# EAGLE design ChargeControllerMainBoard (EAGLE 9.2.2)
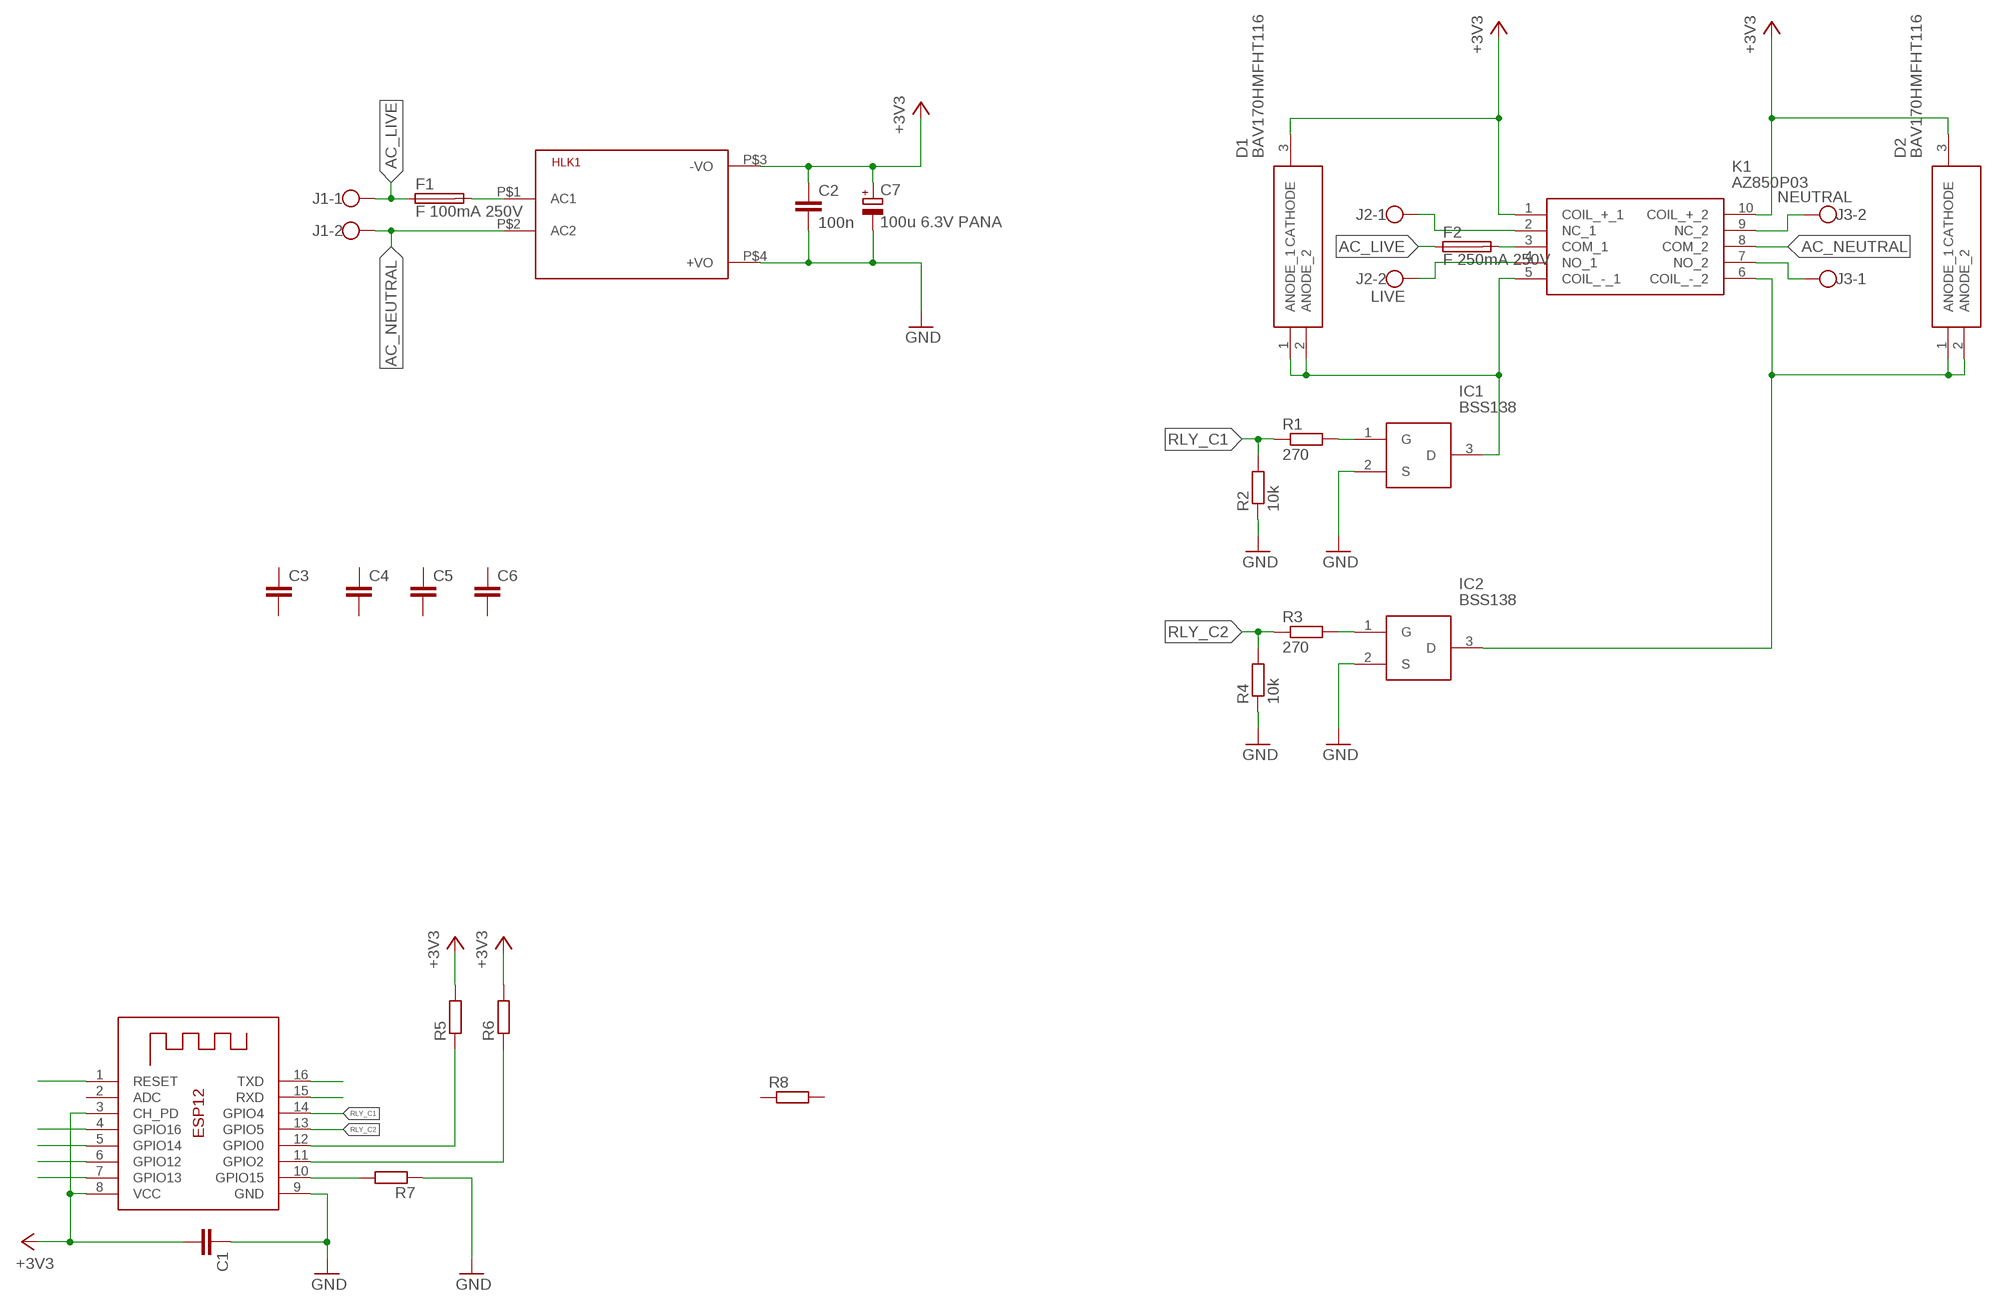
[diagram p0: schematic, sheet 1]

## Parts
C1  C-EUC0805  [C0805]
C2  100n  C-EUC0805  [C0805]
C3  C-EUC0805  [C0805]
C4  C-EUC0805  [C0805]
C5  C-EUC0805  [C0805]
C6  C-EUC0805  [C0805]
C7  100u 6.3V PANA  CPOL-EUB  [PANASONIC_B]
D1  BAV170HMFHT116  [SOT95P240X115-3N]
D2  BAV170HMFHT116  [SOT95P240X115-3N]
F1  F 100mA 250V  SH22,5  [SH22,5]
F2  F 250mA 250V  SH22,5  [SH22,5]
HLK1  HLK-PM03  HLK-PM013W  [HLK-PM01]
IC1  BSS138  [SOT95P240X120-3N]
IC2  BSS138  [SOT95P240X120-3N]
J1  W237-102  [W237-102]
J2  LIVE  W237-102  [W237-102]
J3  NEUTRAL  W237-102  [W237-102]
K1  AZ850P03  AZ850P25  [DIPS763W51P254L1400H525Q10N]
R1  270  R-EU_R0805  [R0805]
R2  10k  R-EU_R0805  [R0805]
R3  270  R-EU_R0805  [R0805]
R4  10k  R-EU_R0805  [R0805]
R5  R-EU_R0805  [R0805]
R6  R-EU_R0805  [R0805]
R7  R-EU_R0805  [R0805]
R8  R-EU_R0805  [R0805]
X1  ESP-12  [ESP-12]

## Nets
+3V3: C1.2 C2.1 C7.+ D1.3(CATHODE) D2.3(CATHODE) HLK1.P$3(-VO) K1.1(COIL_+_1) K1.10(COIL_+_2) R5.2 R6.2 X1.3(CH_PD) X1.8(VCC)
AC_LIVE: F1.1 F2.1 J1.1
AC_NEUTRAL: HLK1.P$2(AC2) J1.2 K1.8(COM_2)
GND: C1.1 C2.2 C7.- HLK1.P$4(+VO) IC1.2(S) IC2.2(S) R2.1 R4.1 R7.1 X1.9(GND)
N$1: IC2.1(G) R3.2
N$2: D1.1(ANODE_1) D1.2(ANODE_2) IC1.3(D) K1.5(COIL_-_1)
N$3: IC1.1(G) R1.2
N$4: D2.1(ANODE_1) D2.2(ANODE_2) IC2.3(D) K1.6(COIL_-_2)
N$6: J2.1 K1.2(NC_1)
N$7: J2.2 K1.4(NO_1)
N$8: J3.2 K1.9(NC_2)
N$10: J3.1 K1.7(NO_2)
N$11: R5.1 X1.12(GPIO0)
N$12: R6.1 X1.11(GPIO2)
N$13: R7.2 X1.10(GPIO15)
N$14: X1.7(GPIO13)
N$15: X1.6(GPIO12)
N$16: X1.5(GPIO14)
N$17: X1.4(GPIO16)
N$18: X1.1(RESET)
N$20: F1.2 HLK1.P$1(AC1)
N$21: X1.15(RXD)
N$22: X1.16(TXD)
N$24: F2.2 K1.3(COM_1)
RLY_C1: R1.1 R2.2 X1.14(GPIO4)
RLY_C2: R3.1 R4.2 X1.13(GPIO5)
Unconnected: C3.1 C3.2 C4.1 C4.2 C5.1 C5.2 C6.1 C6.2 R8.1 R8.2 X1.2(ADC)

## Library data of the parts
C1-C6 = rcl:C-EU: CAPACITOR, European symbol; SPICEPREFIX: C
C7 = rcl:CPOL-EU: POLARIZED CAPACITOR, European symbol; SPICEPREFIX: C
D1 D2 = BAV170HMFHT116:BAV170HMFHT116: Diodes - General Purpose, Power, Switching 90VVrm 80V Vr 0.215A Io 150mA Source: Datasheet <http://rohmfs.rohm.com/en/products/databook/datasheet/discrete/diode/switching/bav170hmfht116-e.pdf>; DESCRIPTION: Diodes - General Purpose, Power, Switching 90VVrm 80V Vr 0.215A Io 150mA; HEIGHT: 1.15mm; MANUFACTURER_NAME: ROHM Semiconductor; MANUFACTURER_PART_NUMBER: BAV170HMFHT116; MOUSER_PART_NUMBER: 755-BAV170HMFHT116; MOUSER_PRICE-STOCK: https://www.mouser.com/Search/Refine.aspx?Keyword=755-BAV170HMFHT116
F1 F2 = fuse:SH22,5: FUSE HOLDER grid 22,5 mm, OGN0031 8201, Schurter (Buerklin); MF: SCHURTER; MPN: 0031.8201; OC_FARNELL: 1162740; OC_NEWARK: 96F8317
HLK1 = HLK-PM01:HLK-PM01: Hi-Link Power Supply HLK-PM01 3W Author: Ahmed Said <https://github.com/AhmedSaid/EAGLELibraries>
IC1 IC2 = BSS138:BSS138: MOSFET N-Channel 50V 0.22A SOT23 Fairchild BSS138 N-channel MOSFET Transistor, 0.22 A, 50 V, 3-Pin SOT-23 Source: Datasheet <http://docs-emea.rs-online.com/webdocs/0d22/0900766b80d22ec5.pdf>; DESCRIPTION: MOSFET N-Channel 50V 0.22A SOT23 Fairchild BSS138 N-channel MOSFET Transistor, 0.22 A, 50 V, 3-Pin SOT-23; HEIGHT: 1.2mm; MANUFACTURER_NAME: Fairchild Semiconductor; MANUFACTURER_PART_NUMBER: BSS138; MOUSER_PART_NUMBER: 512-BSS138; MOUSER_PRICE-STOCK: https://www.mouser.com/Search/Refine.aspx?Keyword=512-BSS138; RS_PART_NUMBER: 1241694; RS_PRICE-STOCK: http://uk.rs-online.com/web/p/products/1241694
J1-J3 = con-wago-500:W237-102: WAGO SCREW CLAMP; MPN: 237-102; OC_FARNELL: unknown; OC_NEWARK: 70K9898
K1 = AZ850P25:AZ850P25: MICROMINIATURE POLARIZED RELAY, 5 VDC, 10 VDC max Source: Datasheet <http://www.azettler.com/pdfs/az850.pdf>; DESCRIPTION: MICROMINIATURE POLARIZED RELAY, 5 VDC, 10 VDC max; HEIGHT: 5.254mm; MANUFACTURER_NAME: American Zettler; MANUFACTURER_PART_NUMBER: AZ850P2&ndash;5
R1-R8 = rcl:R-EU_: RESISTOR, European symbol; SPICEPREFIX: R
X1 = adafruit:ESP-12

## Net classes
0 default: clearance 0.205 mm

## Board
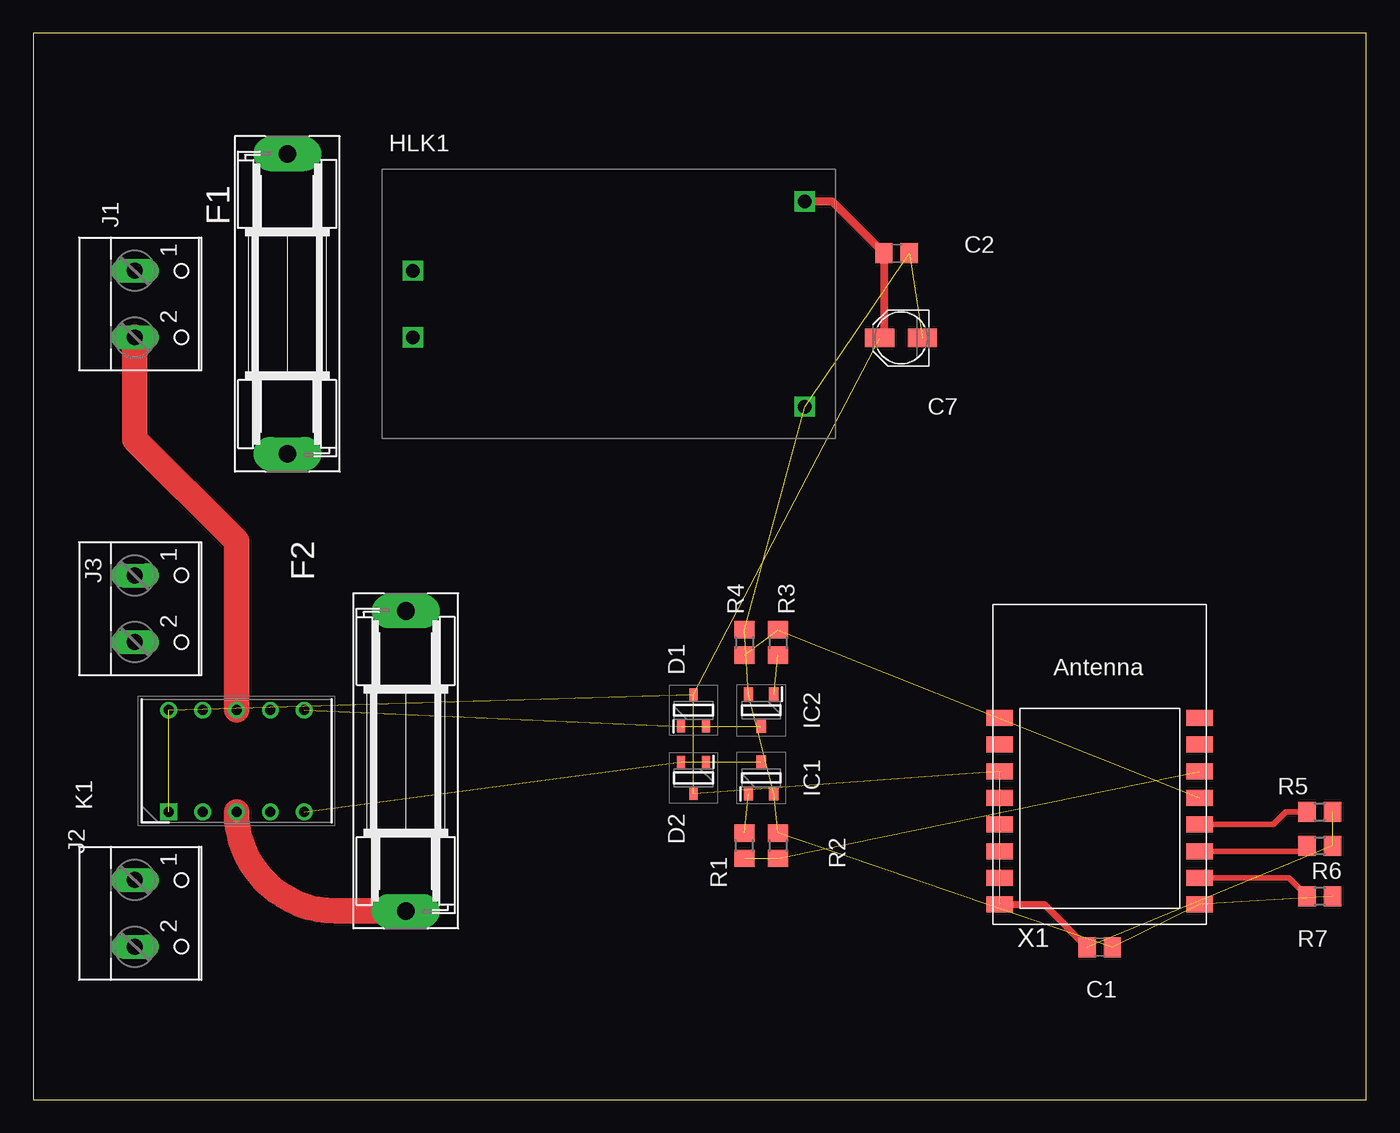
[diagram p1: board, top side]
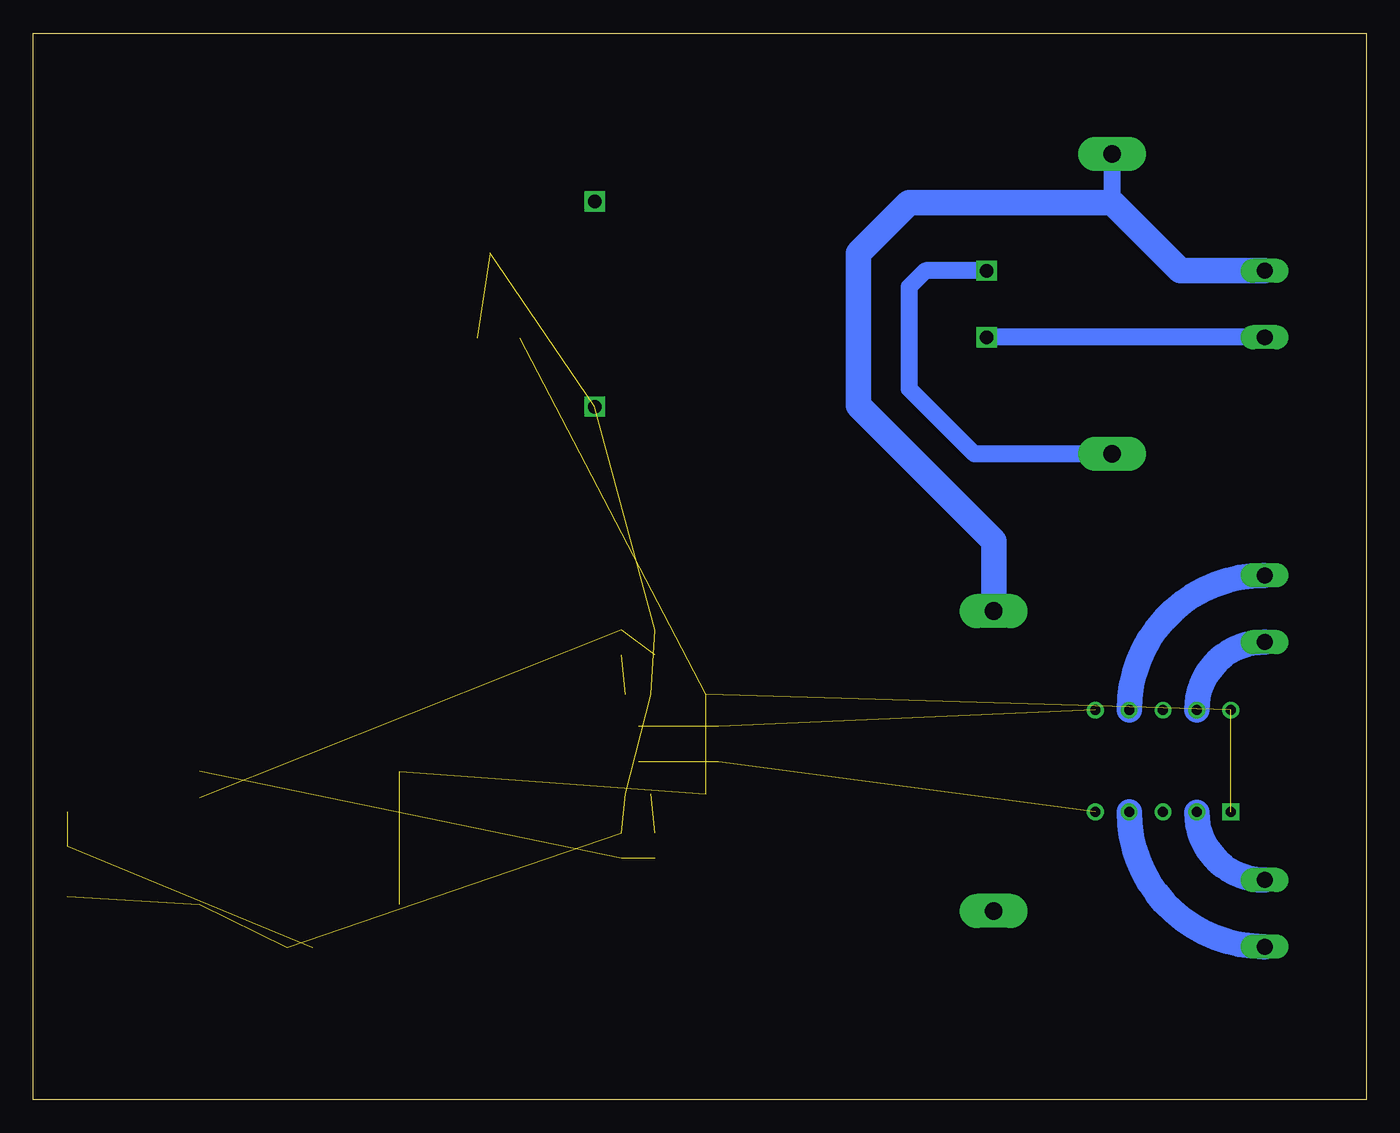
[diagram p2: board, bottom side, seen from below]

Size 100 x 80 mm. Coordinates in mm from the lower left corner, seen from the top.
Outline: 0,0 100,0 100,80 0,80 0,0
Copper layers (1*16): Top 0.035mm / dielectric 1.5mm / Bottom 0.035mm
Design rules "default": minimum track width 6mil, minimum drill 0.35mm, track to track 6mil, track to pad 6mil, pad to pad 6mil, via to via 6mil, smd to smd 6mil, copper to edge 40mil, drill to drill 6mil, minimum pad ring 10mil, minimum via ring 8mil, stop-mask expansion 4mil, vias tented up to drill 0mil, thermal gap 10mil

### Footprints (pad centres in the part's own frame; a part is rotated, then mirrored left to right if it is on the bottom)
C0805 = smd 1.3 x 1.5: 1 -0.95,0; 2 0.95,0
PANASONIC_B = smd 2.2 x 1.4: + 1.6,0; - -1.6,0
SOT95P240X115-3N = smd 0.9 x 0.6: 1 -1.2,0.95; 2 -1.2,-0.95; 3 1.2,0
SH22,5 = drill 1.321 pad 2.54 long: 1 -11.252,0; 2 11.252,0
HLK-PM01 = drill 1.016 square: P$1 -14.7,2.5; P$2 -14.7,-2.5; P$3 14.7,7.7; P$4 14.7,-7.7
SOT95P240X120-3N = smd 1 x 0.7: 1 -1.2,0.95; 2 -1.2,-0.95; 3 1.2,0
W237-102 = drill 1.194 long: 1 -2.5,-1.27; 2 2.5,-1.27
DIPS763W51P254L1400H525Q10N = drill 0.75 pad 1.15 square: 1 0,0 | drill 0.75 pad 1.15: 2 0,-2.54; 3 0,-5.08; 4 0,-7.62; 5 0,-10.16; 6 7.63,-10.16; 7 7.63,-7.62; 8 7.63,-5.08; 9 7.63,-2.54; 10 7.63,0
R0805 = smd 1.3 x 1.5: 1 -0.95,0; 2 0.95,0
ESP-12 = smd 2 x 1.2: 1 -7.5,4.5; 2 -7.5,2.5; 3 -7.5,0.5; 4 -7.5,-1.5; 5 -7.5,-3.5; 6 -7.5,-5.5; 7 -7.5,-7.5; 8 -7.5,-9.5; 9 7.5,-9.5; 10 7.5,-7.5; 11 7.5,-5.5; 12 7.5,-3.5; 13 7.5,-1.5; 14 7.5,0.5; 15 7.5,2.5; 16 7.5,4.5

### Placement (x,y rotation side)
C1  80.01,11.43 180 top
C2  64.77,63.5 0 top
C3  -52.07,-95.25 0 top  (outside the outline)
C4  -52.07,-100.33 0 top  (outside the outline)
C5  -52.07,-105.41 0 top  (outside the outline)
C6  -52.07,-110.49 0 top  (outside the outline)
C7  65.1,57.15 180 top
D1  49.53,24.13 270 top
D2  49.53,29.21 90 top
F1  19.05,59.69 270 top
F2  27.94,25.4 270 top
HLK1  43.18,59.69 0 top
IC1  54.61,24.13 90 top
IC2  54.61,29.21 270 top
J1  8.89,59.69 270 top
J2  8.89,13.97 270 top
J3  8.89,36.83 270 top
K1  10.16,21.59 90 top
R1  53.34,19.05 90 top
R2  55.88,19.05 270 top
R3  55.88,34.29 270 top
R4  53.34,34.29 270 top
R5  96.52,21.59 0 top
R6  96.52,19.05 0 top
R7  96.52,15.24 180 top
R8  -44.45,-43.18 0 top  (outside the outline)
X1  80.01,24.13 0 top

### Tracks (layer width: path | path; a pad name or v marks a point on that pad's centre or on a via)
+3V3  (8 unrouted)
  Top 0.508: X1.8 75.86,14.63 C1.2
  Top 0.61: HLK1.P$3 59.93,67.39 C2.1 63.82,57.47 C7.+
AC_LIVE
  Bottom 1.27: 19.05,67.31 F1.1
  Bottom 1.905: J1.1 13.93,62.19 19.05,67.31 34.29,67.31 38.1,63.5 38.1,52.07 27.94,41.91 F2.1
AC_NEUTRAL
  Top 1.905: K1.8 15.24,41.91 7.62,49.53 J1.2
  Bottom 1.27: J1.2 HLK1.P$2
GND  (9 unrouted)
N$1  (1 unrouted)
N$2  (3 unrouted)
N$3  (1 unrouted)
N$4  (3 unrouted)
N$6
  Bottom 1.27: 12.7,21.55 K1.2
  Bottom 1.905: J2.1 arc90 12.7,21.55
N$7
  Bottom 1.27: J2.2 7.66,11.47
  Bottom 1.905: 7.66,11.47 arc90 K1.4
N$8
  Bottom 1.27: 12.7,29.25 K1.9
  Bottom 1.905: J3.2 arc-90 12.7,29.25
N$10
  Bottom 1.27: J3.1 7.67,39.33
  Bottom 1.905: 7.67,39.33 arc-90 K1.7
N$11
  Top 0.406: X1.12 93.02,20.63 93.98,21.59 R5.1
N$12
  Top 0.406: X1.11 95.15,18.63 R6.1
N$13
  Top 0.406: X1.10 94.18,16.63 R7.2
N$20
  Bottom 1.27: F1.2 29.39,48.44 34.29,53.34 34.29,60.96 33.06,62.19 HLK1.P$1
N$24
  Top 1.905: F2.2 22.68,14.15 arc-90 K1.3
RLY_C1  (2 unrouted)
RLY_C2  (2 unrouted)

### Text on the board
tNames: X1